# Altium schematic sheet JD-ESPFSH-V1.SchDoc: OXII SW SQRE M1 - MCU
size A4; SheetNumber: 1; SheetTotal: 1; xSize: A4; xScale: 1:1
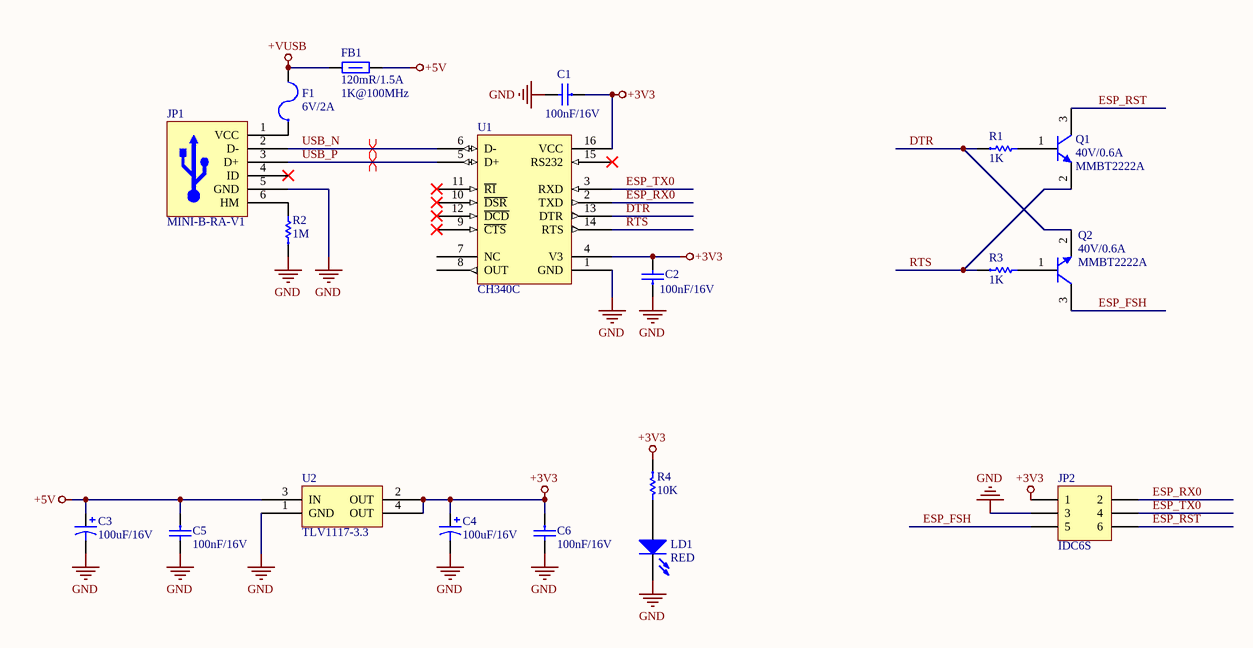
[diagram p0: JD-ESPFSH-V1.SchDoc]

## Parts
C1  100nF/16V  [CAP-CER0603-0.8H]
C2  100nF/16V  [CAP-CER0603-0.8H]
C3  100uF/16V  [CAP-ALU-6.3D5.8H-SMD]
C4  100uF/16V  [CAP-ALU-6.3D5.8H-SMD]
C5  100nF/16V  [CAP-CER0603-0.8H]
C6  100nF/16V  [CAP-CER0603-0.8H]
F1  6V/2A  [FUS-PTC-SMD1206-1.6H]
FB1  120mR/1.5A  NOTE: 1K@100MHz  [IND-C0805-1.1H]
JP1  MINI-B-RA-V1  [CON-USB-MINI-B-RA-V1-SMD]
JP2  IDC6S  [CON-IDC6-2.54P9.3H-S-THR]
LD1  RED  [LED-IND0603-RED-0.6H]
Q1  40V/0.6A  NOTE: MMBT2222A  [SOT23-3-1.1H]
Q2  40V/0.6A  NOTE: MMBT2222A  [SOT23-3-1.1H]
R1  1K  [RES-CHP0603-0.6H]
R2  1M  [RES-CHP0603-0.6H]
R3  1K  [RES-CHP0603-0.6H]
R4  10K  [RES-CHP0603-0.6H]
U1  CH340C  [SOIC-16M-1.75H]
U2  TLV1117-3.3  [SOT223-4N-1.8H]

## Nets
+3V3: C1.1 C2.2 C4.1 C6.1 JP2.1 R4.1 U1.4(V3) U1.16(VCC) U2.2(OUT) U2.4(OUT)
+5V: C3.1 C5.1 FB1.2 U2.3(IN)
+VUSB: F1.2 FB1.1
GND: C1.2 C2.1 C3.2 C4.2 C5.2 C6.2 JP1.5(GND) JP2.3 LD1.2(K) R2.1 U1.1(GND) U2.1(GND)
DTR: Q2.2(E) R1.1 U1.13(DTR)
ESP_FSH: JP2.5 Q2.3(C)
ESP_RST: JP2.6 Q1.3(C)
ESP_RX0: JP2.2 U1.2(TXD)
ESP_TX0: JP2.4 U1.3(RXD)
RTS: Q1.2(E) R3.1 U1.14(RTS)
USB_N: JP1.2(D-) U1.6(D-)
USB_P: JP1.3(D+) U1.5(D+)
NetF1_1: F1.1 JP1.1(VCC)
NetJP1_6: JP1.6(HM) R2.2
NetLD1_1: LD1.1(A) R4.2
NetQ1_1: Q1.1(B) R1.2
NetQ2_1: Q2.1(B) R3.2

Not connected (* = marked no-connect by the designer): JP1 4(ID)*; U1 7(NC) 8(OUT) 9(~{CTS})* 10(~{DSR})* 11(~{RI})* 12(~{DCD})* 15(RS232)*

## Layout directives
differential pair: USB_N, USB_P

## Notes on the sheet
- ENG:
- APPROVALS
- Project:
- Title:
- DSN:
- CHK:
- Model:
- Part:
- Page:
- DSN Name:
- Material:
- Of
- Size:
- Rev:
- Scale:
- APR:
- DWG Name:

## Library data of the parts
C1 C2 = CAPCER0008 0603 100nF/16V: CAP CER 100nF/16V 10% X7R 0603 SMD; MFR PN: CC0603KRX7R7BB104; MFR: YAGEO; LINE: SMT; TYPE: EP; UNIT: PCS; CLASS: B; CERT: NA; PRD CODE: (SAP); MOUNT: SMD; SRT PN: CAPCER0008
C3 C4 = CAPALU0012 6.3X5.8 100uF/16V SMD: CAP ALU 100uF/16V 20% 2K105 2.2P 6.3X5.8 SMD; MFR PN: UUD1C101MCL1GS; MFR: NICHICON; LINE: SMT; TYPE: EP; UNIT: PCS; CERT: NA; CLASS: B; PRD CODE: (SAP); MOUNT: SMD; SRT PN: CAPALU0012
C5 C6 = CAPCER0008 0603 100nF/16V: CAP CER 100nF/16V 10% X7R 0603 SMD; MFR PN: CC0603KRX7R7BB104; MFR: YAGEO; LINE: SMT; TYPE: EP; UNIT: PCS; CERT: NA; CLASS: B; PRD CODE: (SAP); MOUNT: SMD; SRT PN: CAPCER0008
F1 = FUSPTC0001 1206 6V/2A: FUS PTC RST 6V 2A 1206 SMD; MFR PN: MF-NSMF200-2; MFR: BOURNS; LINE: DIP; UNIT: PCS; TYPE: EP; CERT: NA; CLASS: B; PRD CODE: (SAP); MOUNT: MI; SRT PN: FUSPTC0001
FB1 = FILFER0003 0805 120mR/1.5A: FIL FER CHP 1LN 120mR 25% 1.5A 1K@100MHz 0805 SMD; MFR PN: UPZ2012E102-1R5TF; MFR: SUNLORD; LINE: SMT; TYPE: EP; UNIT: PCS; CERT: NA; CLASS: B; PRD CODE: (SAP); MOUNT: SMD; SRT PN: FILFER0003; JLCPCB PN: C98309
JP1 = CONUSB0001 MINI-B-RA-V1: CON USB RCPT MINI-B 5POS RA V1 SMD; MFR PN: MINI-501; MFR: HANBO; UNIT: PCS; LINE: SMT; CERT: NA; CLASS: B; PRD CODE: (SAP); MOUNT: SMD; TYPE: EP; SRT PN: CONUSB0001
JP2 = CONW2B0010 IDC2.54M-6PV: CON W2B IDC2.54M-2X3V-9H THR; MFR PN: BH254V-6P; MFR: XFCN; LINE: DIP; UNIT: PCS; CERT: NA; PRD CODE: (SAP); TYPE: EP; MOUNT: MI; CLASS: NA; NOTE: NA; SRT PN: CONW2B0010
LD1 = LEDIND0001 0603 RED: LED IND RED CLR 2V 20mA 0603 SMD; MFR PN: 150060SS75000; MFR: WURTH; TYPE: EP; UNIT: PCS; LINE: SMT; NOTE: 80mcd~220mcd, 130deg; CERT: NA; CLASS: B; PRD CODE: (SAP); MOUNT: SMD; SRT PN: LEDIND0001
Q1 Q2 = BJTNPN0001 SOT23 40V/0.6A: BJT NPN 40V 0.6A SOT23-3 SMD; MFR PN: MMBT2222ALT1G; MFR: ONSEMI; CLASS: B; LINE: SMT; TYPE: EP; UNIT: PCS; CERT: NA; PRD CODE: (SAP); MOUNT: SMD; SRT PN: BJTNPN0001
R1 R3 = RESCHP0007 0603 1% 1K: RES CHP 1K 1% 1/10W 0603 SMD; MFR PN: RC0603FR-071KL; MFR: YAGEO; LINE: SMT; UNIT: PCS; CLASS: B; CERT: NA; PRD CODE: (SAP); MOUNT: SMD; TYPE: EP; SRT PN: RESCHP0007
R2 = RESCHP0036 0603 1% 1M: RES CHP 1M 1% 1/10W 0603 SMD; MFR PN: RC0603FR-071ML; MFR: YAGEO; LINE: SMT; UNIT: PCS; CERT: NA; CLASS: B; PRD CODE: (SAP); MOUNT: SMD; TYPE: EP; SRT PN: RESCHP0036
R4 = RESCHP0008 0603 1% 10K: RES CHP 10K 1% 1/10W 0603 SMD; MFR PN: RC0603FR-0710KL; MFR: YAGEO; LINE: SMT; UNIT: PCS; CERT: NA; CLASS: B; PRD CODE: (SAP); MOUNT: SMD; TYPE: EP; SRT PN: RESCHP0008
U1 = ICSINT0008 CH340C: ICS INT USB2UART CH340C 16SOIC SMD; MFR: WCH; CERT: NA; CLASS: B; LINE: SMT; UNIT: PCS; PRD CODE: (SAP); MFR PN: CH340C; MOUNT: SMD; TYPE: EP; SRT PN: ICSINT0008
U2 = ICSVRE0001 SOT223 TLV1117-3.3: ICS VRE TLV1117-33 3V3 0.8A SOT223 SMD; MFR PN: TLV1117-33CDCYR; MFR: TI; LINE: SMT; UNIT: PCS; CERT: NA; CLASS: A; PRD CODE: (SAP); MOUNT: SMD; TYPE: EP; SRT PN: ICSVRE0001